# Altium project YN-ETH03.PrjPcb
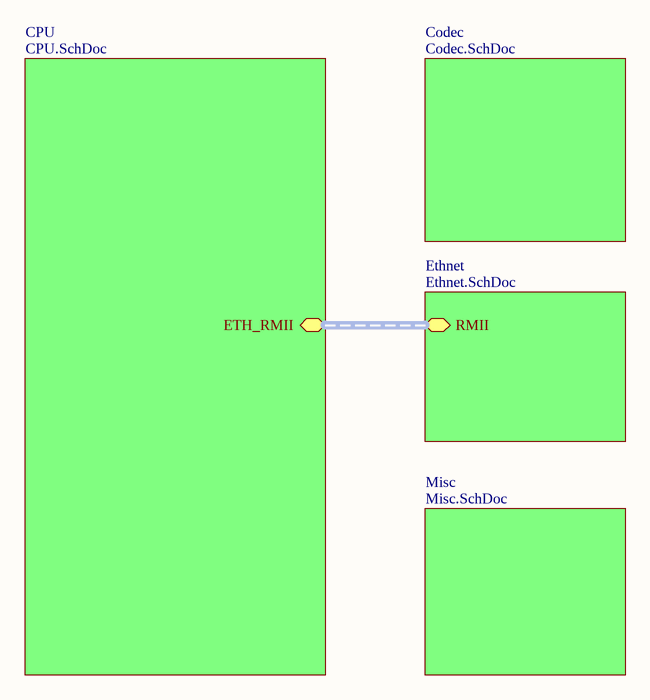
[diagram p0: Top.SchDoc]
5 sheets, 47 parts. Net scope: hierarchical (ports join the sheet entries above them; power ports are global).
Board file: YN-ETH03.PcbDoc
Sheets:
  Top.SchDoc
    CPU = CPU.SchDoc
    Codec = Codec.SchDoc
    Ethnet = Ethnet.SchDoc
    Misc = Misc.SchDoc

## Sheet Top.SchDoc
size A4

### Sub-sheets
Codec = Codec.SchDoc: no entries
CPU = CPU.SchDoc: ETH_RMII (harness RMII)
Ethnet = Ethnet.SchDoc: RMII (harness RMII)
Misc = Misc.SchDoc: no entries

### Buses and harness runs
harness sheet CPU/ETH_RMII = sheet Ethnet/RMII

## Sheet CPU.SchDoc
size A4
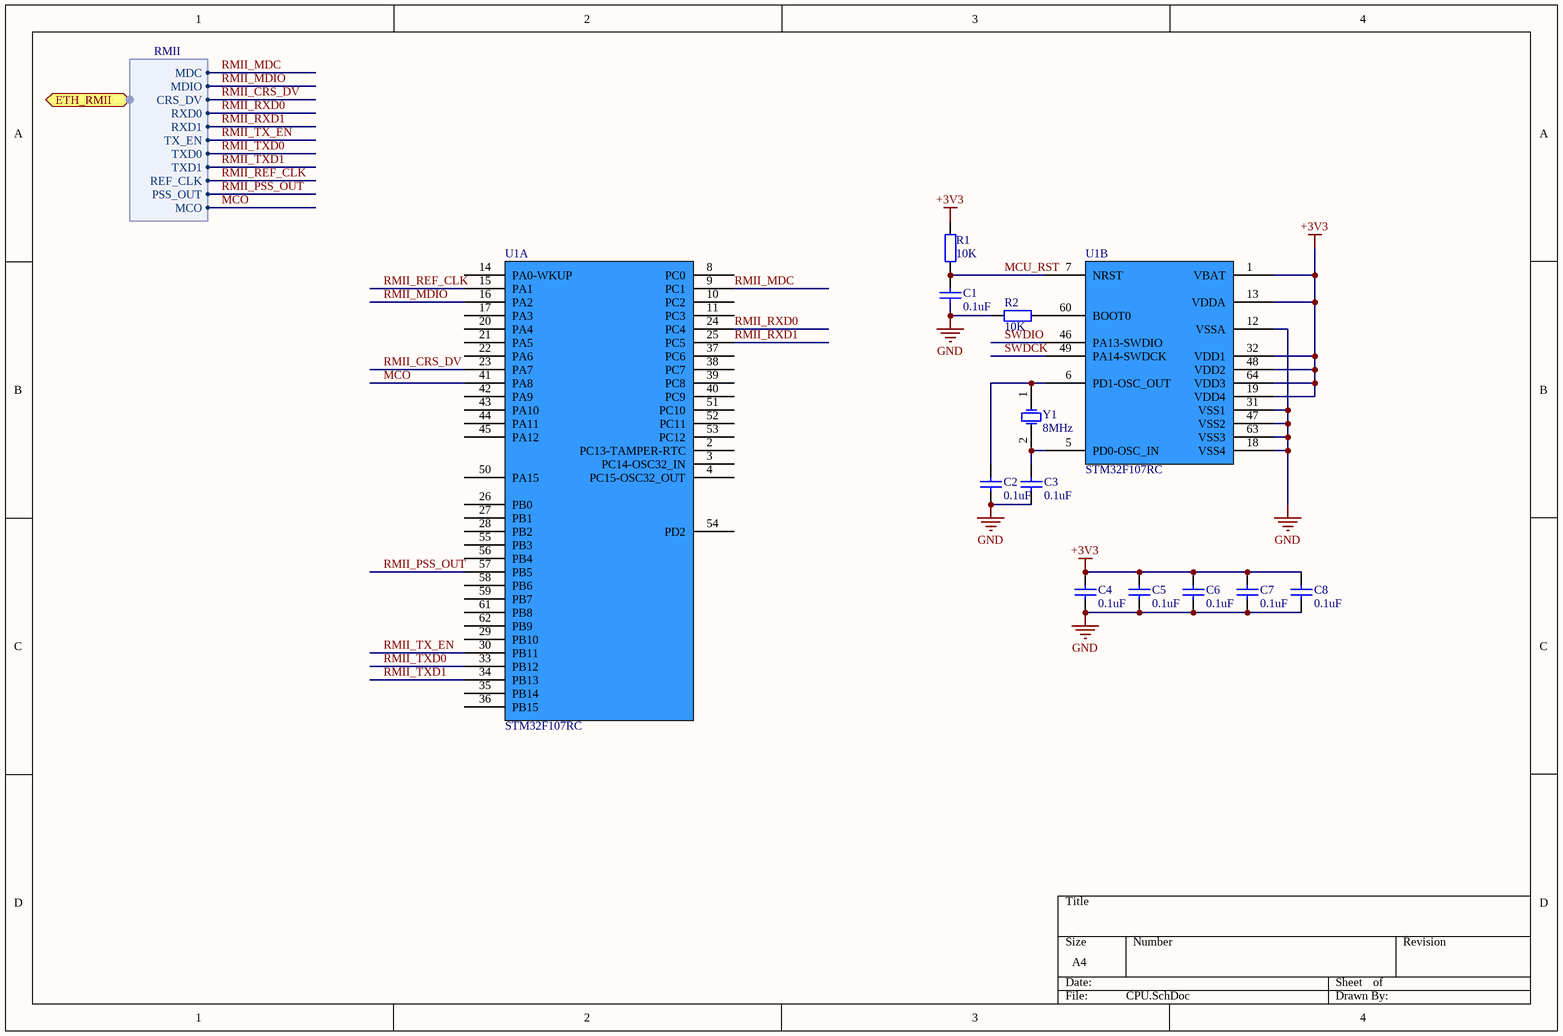
[diagram p1: CPU.SchDoc]

### Parts
C1  0.1uF  [C0805]
C2  0.1uF  [C0805]
C3  0.1uF  [C0805]
C4  0.1uF  [C0805]
C5  0.1uF  [C0805]
C6  0.1uF  [C0805]
C7  0.1uF  [C0805]
C8  0.1uF  [C0805]
R1  10K  [0805]
R2  10K  [0805]
U1  STM32F107RC  [LQFP64]  (parts A,B of 2)
Y1  8MHz  [49S_SMD]

### Ports
ETH_RMII (harness RMII)

### Harnesses
RMII: MDC, MDIO, CRS_DV, RXD0, RXD1, TX_EN, TXD0, TXD1, REF_CLK, PSS_OUT, MCO

### Nets
+3V3: C4.2 C5.2 C6.2 C7.2 C8.2 R1.1 U1.1(VBAT) U1.13(VDDA) U1.19(VDD4) U1.32(VDD1) U1.48(VDD2) U1.64(VDD3)
GND: C1.1 C2.1 C3.1 C4.1 C5.1 C6.1 C7.1 C8.1 R2.2 U1.12(VSSA) U1.18(VSS4) U1.31(VSS1) U1.47(VSS2) U1.63(VSS3)
MCO: U1.41(PA8) ; port ETH_RMII.MCO
MCU_RST: C1.2 R1.2 U1.7(NRST)
RMII_CRS_DV: U1.23(PA7) ; port ETH_RMII.CRS_DV
RMII_MDC: U1.9(PC1) ; port ETH_RMII.MDC
RMII_MDIO: U1.16(PA2) ; port ETH_RMII.MDIO
RMII_PSS_OUT: U1.57(PB5) ; port ETH_RMII.PSS_OUT
RMII_REF_CLK: U1.15(PA1) ; port ETH_RMII.REF_CLK
RMII_RXD0: U1.24(PC4) ; port ETH_RMII.RXD0
RMII_RXD1: U1.25(PC5) ; port ETH_RMII.RXD1
RMII_TX_EN: U1.30(PB11) ; port ETH_RMII.TX_EN
RMII_TXD0: U1.33(PB12) ; port ETH_RMII.TXD0
RMII_TXD1: U1.34(PB13) ; port ETH_RMII.TXD1
SWDCK: U1.49(PA14-SWDCK)
SWDIO: U1.46(PA13-SWDIO)
NetC2_2: C2.2 U1.6(PD1-OSC_OUT) Y1.1(OSC1)
NetC3_2: C3.2 U1.5(PD0-OSC_IN) Y1.2(OSC2)
NetR2_1: R2.1 U1.60(BOOT0)

Not connected (* = marked no-connect by the designer): U1 2(PC13-TAMPER-RTC) 3(PC14-OSC32_IN) 4(PC15-OSC32_OUT) 8(PC0) 10(PC2) 11(PC3) 14(PA0-WKUP) 17(PA3) 20(PA4) 21(PA5) 22(PA6) 26(PB0) 27(PB1) 28(PB2) 29(PB10) 35(PB14) 36(PB15) 37(PC6) 38(PC7) 39(PC8) 40(PC9) 42(PA9) 43(PA10) 44(PA11) 45(PA12) 50(PA15) 51(PC10) 52(PC11) 53(PC12) 54(PD2) 55(PB3) 56(PB4) 58(PB6) 59(PB7) 61(PB8) 62(PB9)

### Library data of the parts
C1-C8 = Cap: 0805贴片电容
R1 R2 = Res2: 0805贴片电阻
U1 = STM32F107Rx
Y1 = XTAL: 25MHz

## Sheet Codec.SchDoc
size A4
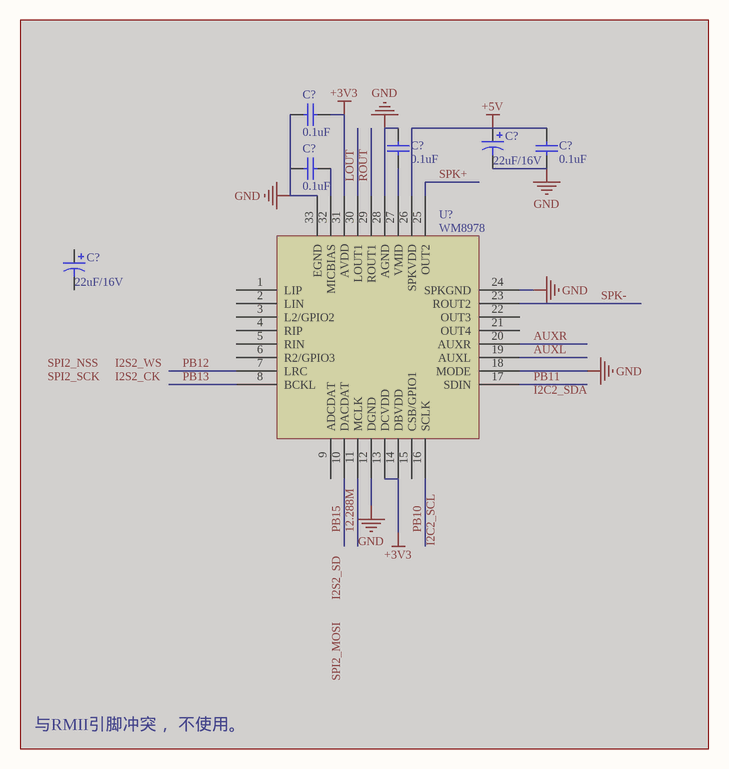
[diagram p2: Codec.SchDoc]

### Parts
(Parts that share a designator on the sheet are numbered #1, #2 ... from top to bottom, then left to right.)
C?#1  0.1uF  [C0805]  (masked out: inside a compile mask, not in the netlist)
C?#2  0.1uF  [C0805]  (masked out: inside a compile mask, not in the netlist)
C?#3  22uF/16V  [C2x3]  (masked out: inside a compile mask, not in the netlist)
C?#4  0.1uF  [C0805]  (masked out: inside a compile mask, not in the netlist)
C?#5  0.1uF  [C0805]  (masked out: inside a compile mask, not in the netlist)
C?#6  22uF/16V  [C2x3]  (masked out: inside a compile mask, not in the netlist)
U?  WM8978  [QFN32]  (masked out: inside a compile mask, not in the netlist)

### Notes on the sheet
- 与RMII引脚冲突， 不使用。

### Library data of the parts
C?#1 C?#2 C?#4 C?#5 = Cap: 0805贴片电容
C?#3 C?#6 = Cap Pol1: 贴片钽电容
U? = WM8978: WM8978 HD Stereo CODEC IC

## Sheet Ethnet.SchDoc
size A4
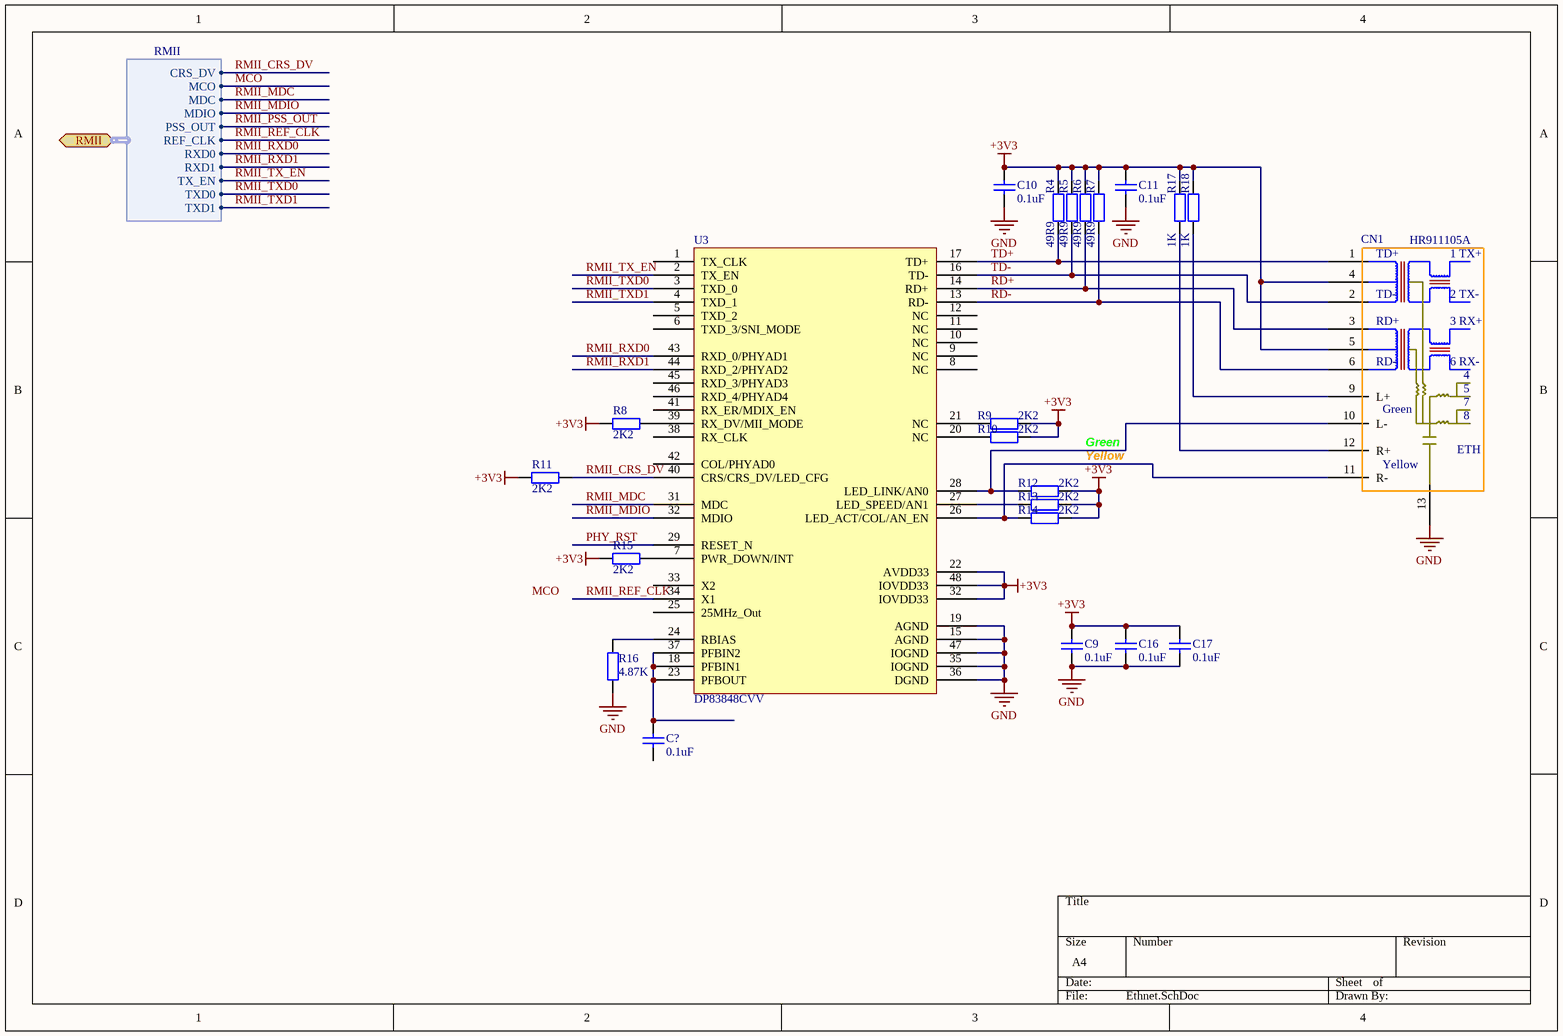
[diagram p3: Ethnet.SchDoc]

### Parts
(Parts that share a designator on the sheet are numbered #1, #2 ... from top to bottom, then left to right.)
C9  0.1uF  [C0805]
C10  0.1uF  [C0805]
C11  0.1uF  [C0805]
C16  0.1uF  [C0805]
C17  0.1uF  [C0805]
C?#7  0.1uF  [C0805]
CN1  HR911105A  [HR911105A]
R4  49R9  [0805]
R5  49R9  [0805]
R6  49R9  [0805]
R7  49R9  [0805]
R8  2K2  [0805]
R9  2K2  [0805]
R10  2K2  [0805]
R11  2K2  [0805]
R12  2K2  [0805]
R13  2K2  [0805]
R14  2K2  [0805]
R15  2K2  [0805]
R16  4.87K  [0805]
R17  1K  [0805]
R18  1K  [0805]
U3  DP83848CVV  [LQFP48]

### Ports
RMII (harness RMII)

### Harnesses
RMII: CRS_DV, MCO, MDC, MDIO, PSS_OUT, REF_CLK, RXD0, RXD1, TX_EN, TXD0, TXD1

### Nets
+3V3: C9.2 C10.2 C11.2 C16.2 C17.2 CN1.4 CN1.5 R4.2 R5.2 R6.2 R7.2 R8.1 R9.2 R10.2 R11.1 R12.2 R13.2 R14.2 R15.1 R17.2 R18.2 U3.22(AVDD33) U3.32(IOVDD33) U3.48(IOVDD33)
GND: C9.1 C10.1 C11.1 C16.1 C17.1 CN1.13 R16.2 U3.15(AGND) U3.19(AGND) U3.35(IOGND) U3.36(DGND) U3.47(IOGND)
PHY_RST: U3.29(RESET_N)
RD+: CN1.3 R6.1 U3.14(RD+)
RD-: CN1.6 R7.1 U3.13(RD-)
RMII_CRS_DV: R11.2 U3.40(CRS/CRS_DV/LED_CFG) ; port RMII.CRS_DV
RMII_MDC: U3.31(MDC) ; port RMII.MDC
RMII_MDIO: U3.32(MDIO) ; port RMII.MDIO
RMII_REF_CLK: U3.34(X1) ; port RMII.REF_CLK
RMII_RXD0: U3.43(RXD_0/PHYAD1) ; port RMII.RXD0
RMII_RXD1: U3.44(RXD_2/PHYAD2) ; port RMII.RXD1
RMII_TX_EN: U3.2(TX_EN) ; port RMII.TX_EN
RMII_TXD0: U3.3(TXD_0) ; port RMII.TXD0
RMII_TXD1: U3.4(TXD_1) ; port RMII.TXD1
TD+: CN1.1 R4.1 U3.17(TD+)
TD-: CN1.2 R5.1 U3.16(TD-)
NetC?#7_2: C?#7.2 U3.18(PFBIN1) U3.23(PFBOUT) U3.37(PFBIN2)
NetCN1_9: CN1.9(L+) R18.1
NetCN1_10: CN1.10(L-) R12.1 U3.28(LED_LINK/AN0)
NetCN1_11: CN1.11(R-) R14.1 U3.26(LED_ACT/COL/AN_EN)
NetCN1_12: CN1.12(R+) R17.1
NetR8_2: R8.2 U3.39(RX_DV/MII_MODE)
NetR9_1: R9.1 U3.21(NC)
NetR10_1: R10.1 U3.20(NC)
NetR13_1: R13.1 U3.27(LED_SPEED/AN1)
NetR15_2: R15.2 U3.7(PWR_DOWN/INT)
NetR16_1: R16.1 U3.24(RBIAS)

Not connected (* = marked no-connect by the designer): C?#7 1; U3 1(TX_CLK) 5(TXD_2) 6(TXD_3/SNI_MODE) 8(NC) 9(NC) 10(NC) 11(NC) 12(NC) 25(25MHz_Out) 33(X2) 38(RX_CLK) 41(RX_ER/MDIX_EN) 42(COL/PHYAD0) 45(RXD_3/PHYAD3) 46(RXD_4/PHYAD4)

### Notes on the sheet
- Green
- Yellow
- Labels drawn without touching a wire or pin: MCO
- (in symbol HR911105A) TD+; 1 TX+; TD-; 2 TX-; RD+; 3 RX+; RD-; 6 RX-; 7; Green; 8; ETH; Yellow

### Library data of the parts
C9-C11 C16 C17 C?#7 = Cap: 0805贴片电容
R4-R18 = Res2: 0805贴片电阻
U3 = DP83848

## Sheet Misc.SchDoc
size A4
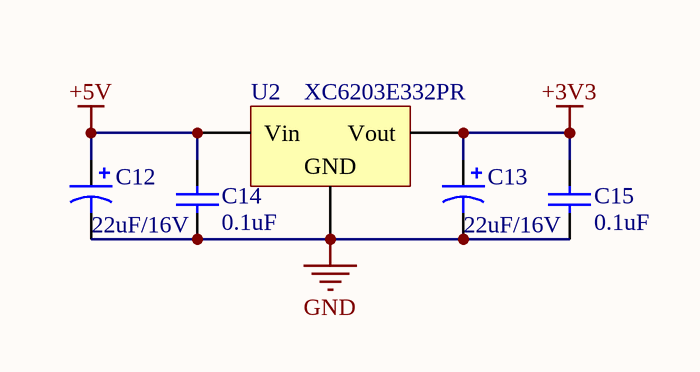
[diagram p4: Misc.SchDoc]

### Parts
C12  22uF/16V  [C2x3]
C13  22uF/16V  [C2x3]
C14  0.1uF  [C0805]
C15  0.1uF  [C0805]
U2  XC6203E332PR  [SOT89N]

### Nets
+3V3: C13.1 C15.2 U2.3(Vout)
+5V: C12.1 C14.2 U2.2(Vin)
GND: C12.2 C13.2 C14.1 C15.1 U2.1(GND)

### Library data of the parts
C12 C13 = Cap Pol1: 贴片钽电容
C14 C15 = Cap: 0805贴片电容
U2 = XC6203: 3.3V 400mA LDO

## Nets that join several sheets
+3V3: CPU (12 pins), Ethnet (24 pins), Misc (C13.1 C15.2 U2.3)
GND: CPU (14 pins), Ethnet (12 pins), Misc (5 pins)
RMII_CRS_DV: CPU (U1.23), Ethnet (R11.2 U3.40)
RMII_MDC: CPU (U1.9), Ethnet (U3.31)
RMII_MDIO: CPU (U1.16), Ethnet (U3.32)
RMII_REF_CLK: CPU (U1.15), Ethnet (U3.34)
RMII_RXD0: CPU (U1.24), Ethnet (U3.43)
RMII_RXD1: CPU (U1.25), Ethnet (U3.44)
RMII_TX_EN: CPU (U1.30), Ethnet (U3.2)
RMII_TXD0: CPU (U1.33), Ethnet (U3.3)
RMII_TXD1: CPU (U1.34), Ethnet (U3.4)